# Altium project AD.PrjPCB
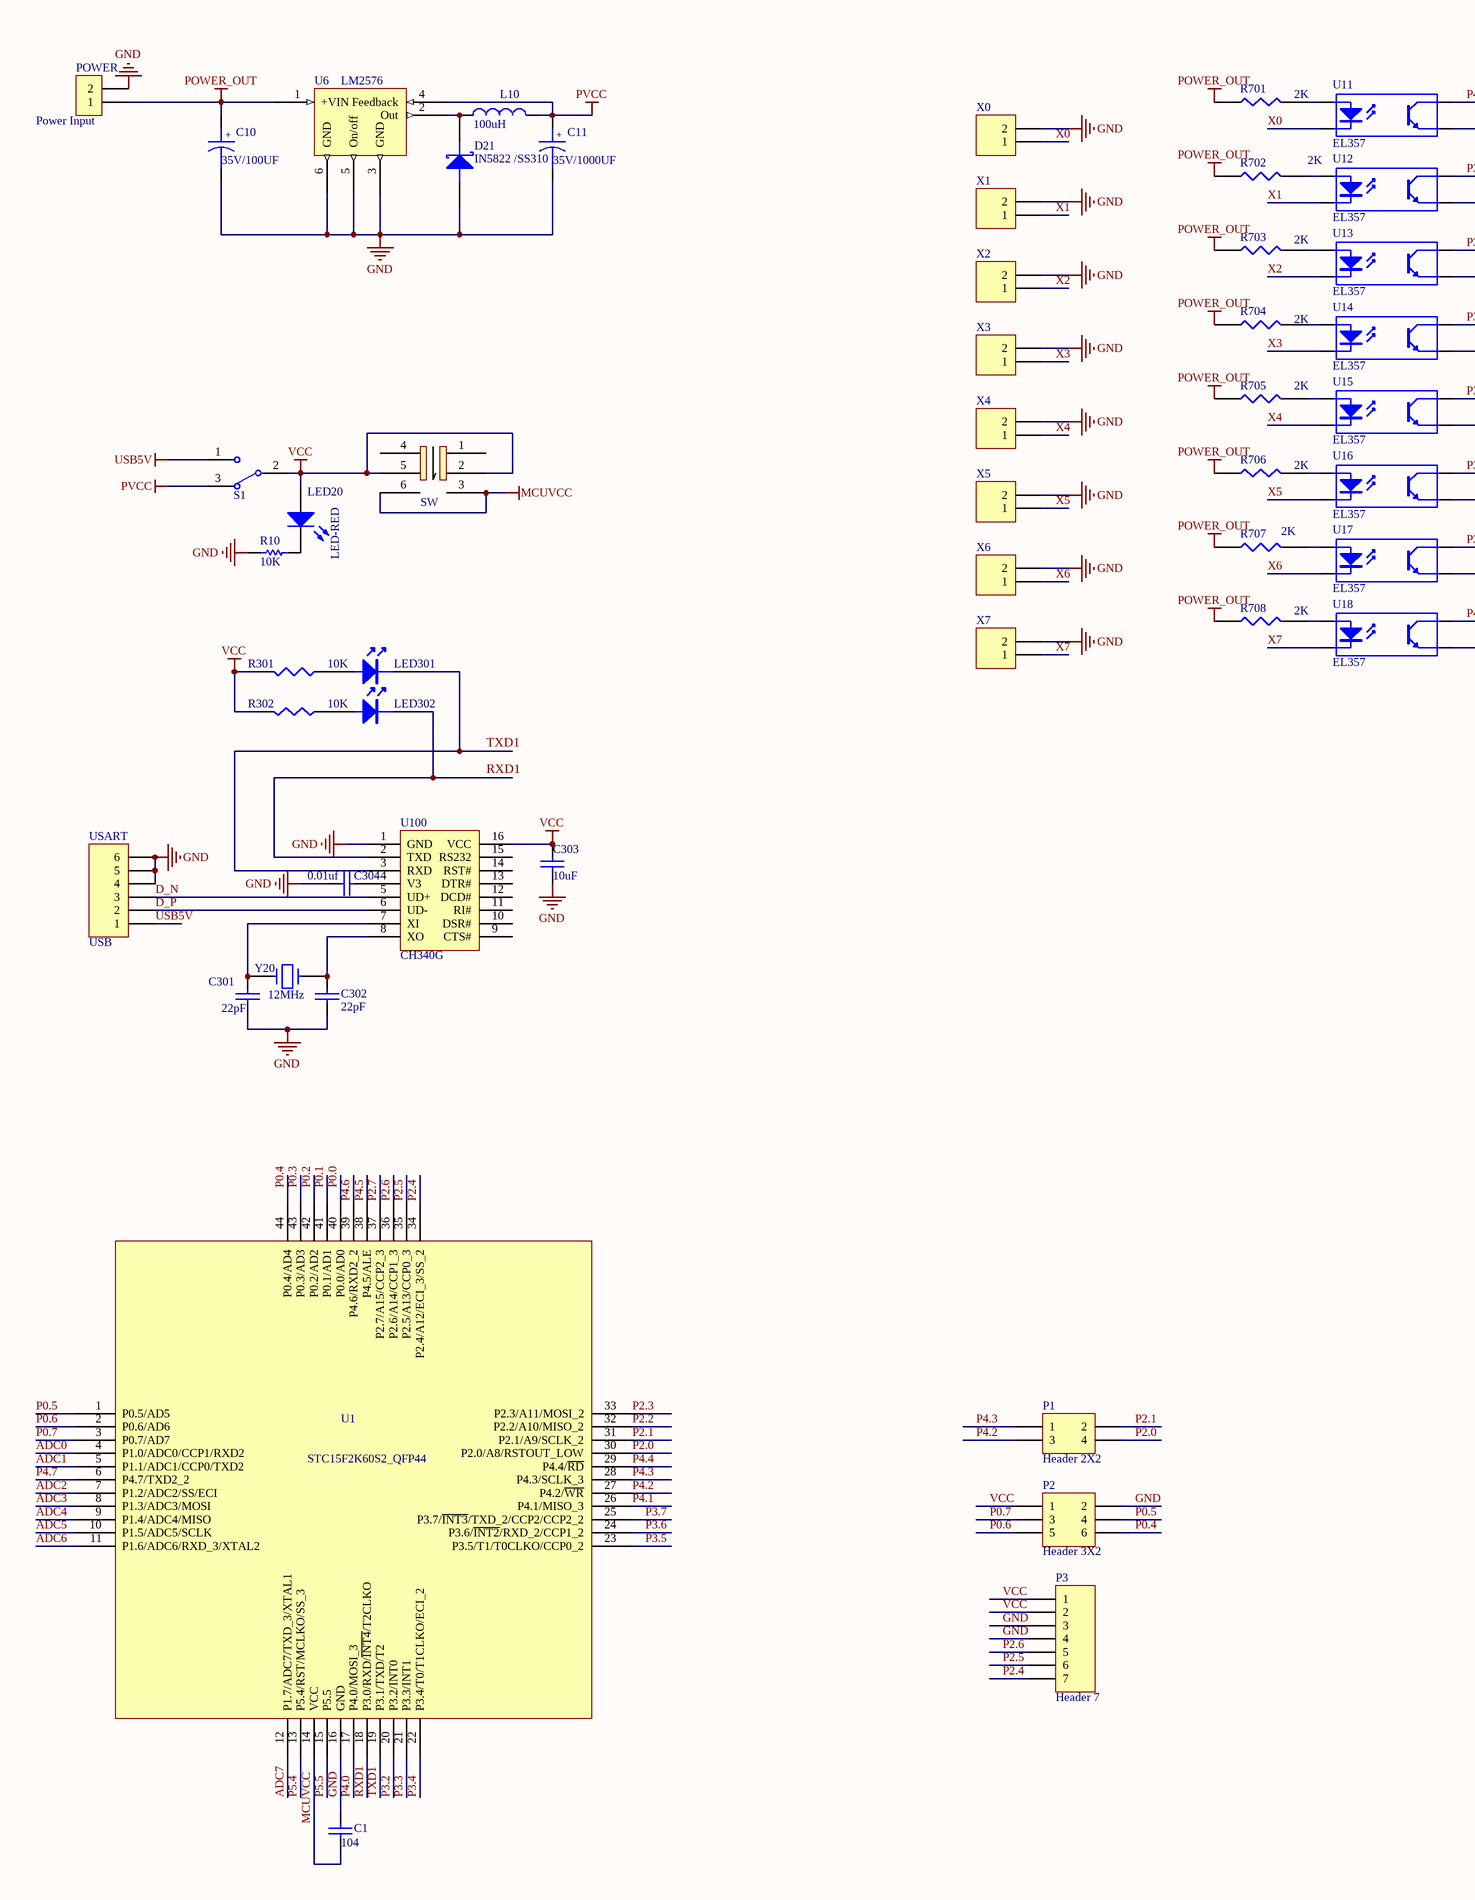
[diagram p0: AD.SchDoc, left]
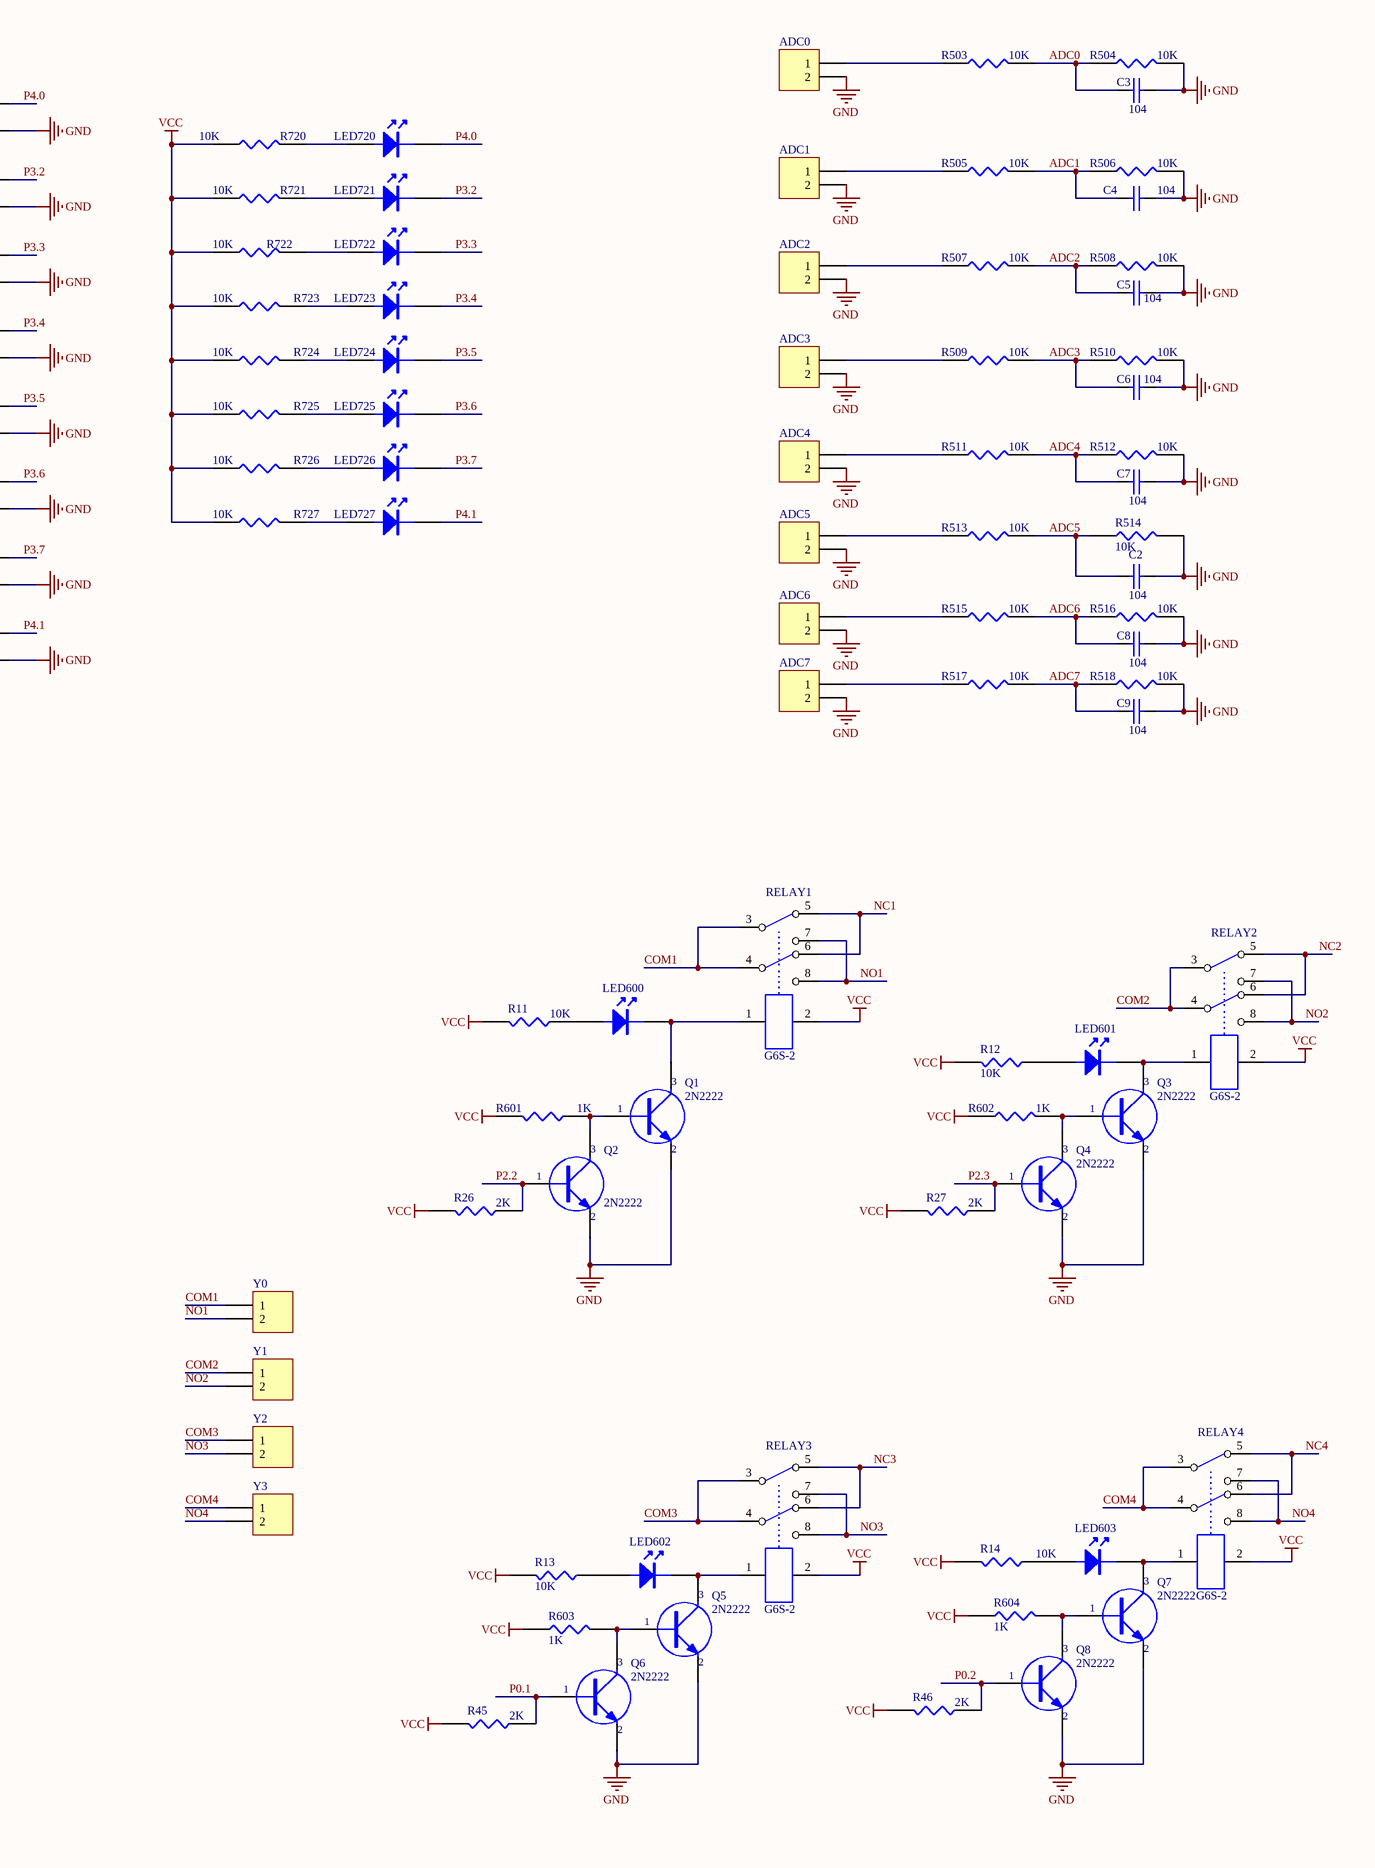
[diagram p1: AD.SchDoc, right]
1 sheet, 130 parts. Net scope: global (net labels, ports and power ports of the same name join across sheets).
Board file: AD.PcbDoc

## Sheet AD.SchDoc
size A2

### Parts
ADC0  ADC  [CON2_1]  (value not drawn)
ADC1  ADC  [CON2_1]  (value not drawn)
ADC2  ADC  [CON2_1]  (value not drawn)
ADC3  ADC  [CON2_1]  (value not drawn)
ADC4  ADC  [CON2_1]  (value not drawn)
ADC5  ADC  [CON2_1]  (value not drawn)
ADC6  ADC  [CON2_1]  (value not drawn)
ADC7  ADC  [CON2_1]  (value not drawn)
C1  104  [R0805]
C2  104  [R0805]
C3  104  [R0805]
C4  104  [R0805]
C5  104  [R0805]
C6  104  [R0805]
C7  104  [R0805]
C8  104  [R0805]
C9  104  [R0805]
C10  35V/100UF  [RB]
C11  35V/1000UF  [L-DIP]
C301  22pF  [C-0805]
C302  22pF  [C-0805]
C303  10uF  [R0805]
C304  0.01uf  [C-0805]
D21  IN5822 /SS310  [DO-214AC]
L10  100uH  [L-DIP]
LED20  LED-RED  [led-0805]
LED301  (no value)  [LED-0805]
LED302  (no value)  [LED-0805]
LED600  (no value)  [LED-0805]
LED601  (no value)  [LED-0805]
LED602  (no value)  [LED-0805]
LED603  (no value)  [LED-0805]
LED720  LED  [LED-0805]  (value not drawn)
LED721  LED  [LED-0805]  (value not drawn)
LED722  LED  [LED-0805]  (value not drawn)
LED723  LED  [LED-0805]  (value not drawn)
LED724  LED  [LED-0805]  (value not drawn)
LED725  LED  [LED-0805]  (value not drawn)
LED726  LED  [LED-0805]  (value not drawn)
LED727  LED  [LED-0805]  (value not drawn)
P1  Header 2X2  [HDR2X2]
P2  Header 3X2  [HDR2X3]
P3  Header 7  [HDR1X7]
POWER  Power Input  [CON2_1]
Q1  2N2222  [SOT23A]
Q2  2N2222  [SOT23A]
Q3  2N2222  [SOT23A]
Q4  2N2222  [SOT23A]
Q5  2N2222  [SOT23A]
Q6  2N2222  [SOT23A]
Q7  2N2222  [SOT23A]
Q8  2N2222  [SOT23A]
R10  10K  [R0805]
R11  10K  [R0805]
R12  10K  [R0805]
R13  10K  [R0805]
R14  10K  [R0805]
R26  2K  [R0805]
R27  2K  [R0805]
R45  2K  [R0805]
R46  2K  [R0805]
R301  10K  [R0805]
R302  10K  [R0805]
R503  10K  [R0805]
R504  10K  [R0805]
R505  10K  [R0805]
R506  10K  [R0805]
R507  10K  [R0805]
R508  10K  [R0805]
R509  10K  [R0805]
R510  10K  [R0805]
R511  10K  [R0805]
R512  10K  [R0805]
R513  10K  [R0805]
R514  10K  [R0805]
R515  10K  [R0805]
R516  10K  [R0805]
R517  10K  [R0805]
R518  10K  [R0805]
R601  1K  [R0805]
R602  1K  [R0805]
R603  1K  [R0805]
R604  1K  [R0805]
R701  2K  [R0805]
R702  2K  [R0805]
R703  2K  [R0805]
R704  2K  [R0805]
R705  2K  [R0805]
R706  2K  [R0805]
R707  2K  [R0805]
R708  2K  [R0805]
R720  10K  [R0805]
R721  10K  [R0805]
R722  10K  [R0805]
R723  10K  [R0805]
R724  10K  [R0805]
R725  10K  [R0805]
R726  10K  [R0805]
R727  10K  [R0805]
RELAY1  G6S-2  [G6S-2]
RELAY2  G6S-2  [G6S-2]
RELAY3  G6S-2  [G6S-2]
RELAY4  G6S-2  [G6S-2]
S1  SW-SPDT_2  [SW_1]  (value not drawn)
SW  SW  [SW]
U1  STC15F2K60S2_QFP44  [PQFP44]
U6  LM2576  [LM2576]
U11  EL357  [el357]
U12  EL357  [EL357]
U13  EL357  [EL357]
U14  EL357  [EL357]
U15  EL357  [EL357]
U16  EL357  [EL357]
U17  EL357  [EL357]
U18  EL357  [EL357]
U100  CH340G  [CH340G]
USART  USB  [USB2.0_A]
X0  XH2.54  [con2_1]  (value not drawn)
X1  XH2.54  [con2_1]  (value not drawn)
X2  XH2.54  [con2_1]  (value not drawn)
X3  XH2.54  [con2_1]  (value not drawn)
X4  XH2.54  [con2_1]  (value not drawn)
X5  XH2.54  [con2_1]  (value not drawn)
X6  XH2.54  [con2_1]  (value not drawn)
X7  XH2.54  [con2_1]  (value not drawn)
Y0  Header 2  [CON2_1]  (value not drawn)
Y1  Header 2  [CON2_1]  (value not drawn)
Y2  Header 2  [CON2_1]  (value not drawn)
Y3  Header 2  [CON2_1]  (value not drawn)
Y20  12MHz  [XTAL1]

### Nets
GND: ADC0.2 ADC1.2 ADC2.2 ADC3.2 ADC4.2 ADC5.2 ADC6.2 ADC7.2 C1.2 C2.2 C3.1 C4.1 C5.1 C6.1 C7.1 C8.1 C9.1 C10.2 C11.2 C301.2 C302.2 C303.2 C304.1 D21.1(A) P2.2 P3.3 P3.4 POWER.2 Q1.2(E) Q2.2(E) Q3.2(E) Q4.2(E) Q5.2(E) Q6.2(E) Q7.2(E) Q8.2(E) R10.1 R504.2 R506.2 R508.2 R510.2 R512.2 R514.2 R516.2 R518.2 U1.16(GND) U6.3(GND) U6.5(On/off) U6.6(GND) U11.3(E) U12.3(E) U13.3(E) U14.3(E) U15.3(E) U16.3(E) U17.3(E) U18.3(E) U100.1(GND) USART.4 USART.5 USART.6 X0.2 X1.2 X2.2 X3.2 X4.2 X5.2 X6.2 X7.2
MCUVCC: C1.1 SW.3 SW.6 U1.14(VCC)
POWER_OUT: C10.1 POWER.1 R701.1 R702.1 R703.1 R704.1 R705.1 R706.1 R707.1 R708.1 U6.1(+VIN)
PVCC: C11.1 L10.2 S1.3 U6.4(Feedback)
USB5V: S1.1 USART.1
VCC: C303.1 LED20.1(A) P2.1 P3.1 P3.2 R11.2 R12.2 R13.2 R14.2 R26.2 R27.2 R45.2 R46.2 R301.2 R302.2 R601.2 R602.1 R603.1 R604.1 R720.1 R721.1 R722.1 R723.1 R724.1 R725.1 R726.1 R727.1 RELAY1.2 RELAY2.2 RELAY3.2 RELAY4.2 S1.2 SW.2 SW.5 U100.16(VCC)
ADC0: C3.2 R503.2 R504.1 U1.4(P1.0/ADC0/CCP1/RXD2)
ADC1: C4.2 R505.2 R506.1 U1.5(P1.1/ADC1/CCP0/TXD2)
ADC2: C5.2 R507.2 R508.1 U1.7(P1.2/ADC2/SS/ECI)
ADC3: C6.2 R509.2 R510.1 U1.8(P1.3/ADC3/MOSI)
ADC4: C7.2 R511.2 R512.1 U1.9(P1.4/ADC4/MISO)
ADC5: C2.1 R513.2 R514.1 U1.10(P1.5/ADC5/SCLK)
ADC6: C8.2 R515.2 R516.1 U1.11(P1.6/ADC6/RXD_3/XTAL2)
ADC7: C9.2 R517.2 R518.1 U1.12(P1.7/ADC7/TXD_3/XTAL1)
COM1: RELAY1.3 RELAY1.4 Y0.1
COM2: RELAY2.3 RELAY2.4 Y1.1
COM3: RELAY3.3 RELAY3.4 Y2.1
COM4: RELAY4.3 RELAY4.4 Y3.1
D_N: U100.5(UD+) USART.3
D_P: U100.6(UD-) USART.2
NC1: RELAY1.5 RELAY1.6
NC2: RELAY2.5 RELAY2.6
NC3: RELAY3.5 RELAY3.6
NC4: RELAY4.5 RELAY4.6
NO1: RELAY1.7 RELAY1.8 Y0.2
NO2: RELAY2.7 RELAY2.8 Y1.2
NO3: RELAY3.7 RELAY3.8 Y2.2
NO4: RELAY4.7 RELAY4.8 Y3.2
P0.0: U1.40(P0.0/AD0)
P0.1: Q6.1(B) R45.1 U1.41(P0.1/AD1)
P0.2: Q8.1(B) R46.1 U1.42(P0.2/AD2)
P0.3: U1.43(P0.3/AD3)
P0.4: P2.6 U1.44(P0.4/AD4)
P0.5: P2.4 U1.1(P0.5/AD5)
P0.6: P2.5 U1.2(P0.6/AD6)
P0.7: P2.3 U1.3(P0.7/AD7)
P2.0: P1.4 U1.30(P2.0/A8/RSTOUT_LOW)
P2.1: P1.2 U1.31(P2.1/A9/SCLK_2)
P2.2: Q2.1(B) R26.1 U1.32(P2.2/A10/MISO_2)
P2.3: Q4.1(B) R27.1 U1.33(P2.3/A11/MOSI_2)
P2.4: P3.7 U1.34(P2.4/A12/ECI_3/SS_2)
P2.5: P3.6 U1.35(P2.5/A13/CCP0_3)
P2.6: P3.5 U1.36(P2.6/A14/CCP1_3)
P2.7: U1.37(P2.7/A15/CCP2_3)
P3.2: LED721.2 U1.20(P3.2/INT0) U12.4(C)
P3.3: LED722.2 U1.21(P3.3/INT1) U13.4(C)
P3.4: LED723.2 U1.22(P3.4/T0/T1CLKO/ECI_2) U14.4(C)
P3.5: LED724.2 U1.23(P3.5/T1/T0CLKO/CCP0_2) U15.4(C)
P3.6: LED725.2 U1.24(P3.6/~{INT2}/RXD_2/CCP1_2) U16.4(C)
P3.7: LED726.2 U1.25(P3.7/~{INT3}/TXD_2/CCP2/CCP2_2) U17.4(C)
P4.0: LED720.2 U1.17(P4.0/MOSI_3) U11.4(C)
P4.1: LED727.2 U1.26(P4.1/MISO_3) U18.4(C)
P4.2: P1.3 U1.27(P4.2/~{WR})
P4.3: P1.1 U1.28(P4.3/SCLK_3)
P4.4: U1.29(P4.4/~{RD})
P4.5: U1.38(P4.5/ALE)
P4.6: U1.39(P4.6/RXD2_2)
P4.7: U1.6(P4.7/TXD2_2)
P5.4: U1.13(P5.4/RST/MCLKO/SS_3)
P5.5: U1.15(P5.5)
RXD1: LED302.2 U1.18(P3.0/RXD/~{INT4}/T2CLKO) U100.2(TXD)
TXD1: LED301.2 U1.19(P3.1/TXD/T2) U100.3(RXD)
X0: U11.2(K) X0.1
X1: U12.2(K) X1.1
X2: U13.2(K) X2.1
X3: U14.2(K) X3.1
X4: U15.2(K) X4.1
X5: U16.2(K) X5.1
X6: U17.2(K) X6.1
X7: U18.2(K) X7.1
NetADC0_1: ADC0.1 R503.1
NetADC1_1: ADC1.1 R505.1
NetADC2_1: ADC2.1 R507.1
NetADC3_1: ADC3.1 R509.1
NetADC4_1: ADC4.1 R511.1
NetADC5_1: ADC5.1 R513.1
NetADC6_1: ADC6.1 R515.1
NetADC7_1: ADC7.1 R517.1
NetC301_1: C301.1 U100.7(XI) Y20.1
NetC302_1: C302.1 U100.8(XO) Y20.2
NetC304_2: C304.2 U100.4(V3)
NetD21_2: D21.2(K) L10.1 U6.2(Out)
NetLED20_2: LED20.2(K) R10.2
NetLED301_1: LED301.1 R301.1
NetLED302_1: LED302.1 R302.1
NetLED600_1: LED600.1 R11.1
NetLED600_2: LED600.2 Q1.3(C) RELAY1.1
NetLED601_1: LED601.1 R12.1
NetLED601_2: LED601.2 Q3.3(C) RELAY2.1
NetLED602_1: LED602.1 R13.1
NetLED602_2: LED602.2 Q5.3(C) RELAY3.1
NetLED603_1: LED603.1 R14.1
NetLED603_2: LED603.2 Q7.3(C) RELAY4.1
NetLED720_1: LED720.1 R720.2
NetLED721_1: LED721.1 R721.2
NetLED722_1: LED722.1 R722.2
NetLED723_1: LED723.1 R723.2
NetLED724_1: LED724.1 R724.2
NetLED725_1: LED725.1 R725.2
NetLED726_1: LED726.1 R726.2
NetLED727_1: LED727.1 R727.2
NetQ1_1: Q1.1(B) Q2.3(C) R601.1
NetQ3_1: Q3.1(B) Q4.3(C) R602.2
NetQ5_1: Q5.1(B) Q6.3(C) R603.2
NetQ7_1: Q7.1(B) Q8.3(C) R604.2
NetR701_2: R701.2 U11.1(A)
NetR702_2: R702.2 U12.1(A)
NetR703_2: R703.2 U13.1(A)
NetR704_2: R704.2 U14.1(A)
NetR705_2: R705.2 U15.1(A)
NetR706_2: R706.2 U16.1(A)
NetR707_2: R707.2 U17.1(A)
NetR708_2: R708.2 U18.1(A)

Not connected (* = marked no-connect by the designer): SW 1 4; U100 9(CTS#) 10(DSR#) 11(RI#) 12(DCD#) 13(DTR#) 14(RST#) 15(RS232)

### Notes on the sheet
- (in symbol CAP2) +

### Library data of the parts
ADC0-ADC7 X0-X7 Y0-Y3 = Header 2: Header, 2-Pin; LatestRevisionDate: 17-Jul-2002; LatestRevisionNote: Re-released for DXP Platform.; Publisher: Altium Limited
C1-C9 C301-C304 = CAP1
C10 C11 = CAP2
D21 = DIODE SCHOTTKY: Schottky Diode
L10 = Inductor: Code_IEC: 1005; Published: 8-Jun-2000; LatestRevisionDate: 17-Jul-2002; LatestRevisionNote: Re-released for DXP Platform.; PackageReference: 0402-A; Publisher: Altium Limited; Code_JEITA: 0402
LED20 = LED0: Typical INFRARED GaAs LED; Published: 8-Jun-2000; LatestRevisionDate: 08-Jul-2005; LatestRevisionNote: Mech Layer 1 removed.; PackageReference: LED-0; Publisher: Altium Limited
LED301 LED302 LED600-LED603 = LED
P1 = Header 2X2: Header, 2-Pin, Dual row; LatestRevisionDate: 17-Jul-2002; LatestRevisionNote: Re-released for DXP Platform.; Publisher: Altium Limited
P2 = Header 3X2: Header, 3-Pin, Dual row; LatestRevisionDate: 17-Jul-2002; LatestRevisionNote: Re-released for DXP Platform.; Publisher: Altium Limited
P3 = Header 7: Header, 7-Pin; LatestRevisionDate: 17-Jul-2002; LatestRevisionNote: Re-released for DXP Platform.; Publisher: Altium Limited
POWER = CON2
Q1-Q8 = NPN_S8050: NPN Transistor
R10 = Res Semi: Semiconductor Resistor; Value: 2k; Published: 8-Jun-2000; LatestRevisionDate: 17-Jul-2002; LatestRevisionNote: Re-released for DXP Platform.; PackageReference: AXIAL-0.5; Publisher: Altium Limited
R11-R14 R26 R27 R45 R46 R503-R518 R601-R604 R701-R708 R720-R727 = RES
R301 = Res3: Resistor; Published: 8-Jun-2000; LatestRevisionDate: 04-Mar-2005; LatestRevisionNote: PCB Footprint replaced.; PackageReference: J1-0603; Publisher: Altium Limited; Value: 10K
R302 = Res3: Resistor; Value: 2K; Published: 8-Jun-2000; LatestRevisionDate: 04-Mar-2005; LatestRevisionNote: PCB Footprint replaced.; PackageReference: J1-0603; Publisher: Altium Limited
RELAY1-RELAY4 = RELAY-G6S-2
S1 = SW-SPDT_2: SPDT Subminiature Toggle Switch, Right Angle Mounting, Vertical Actuation; Published: 24-Mar-1999; LatestRevisionDate: 17-Dec-2003; LatestRevisionNote: Schematic revised, PCB Footprint replaced.; DatasheetDocument: 05-Dec-2000; PackageReference: TL36WW15050; Publisher: Altium Limited; ComponentLink1Description: Manufacturer Link; ComponentLink1URL: http://www.apem.com
U11-U18 = Optoisolator: 4-Pin Phototransistor Optocoupler; Published: 24-Mar-1999; LatestRevisionDate: 04-Mar-2005; LatestRevisionNote: Sch pins 3 & 4 Swapped.; DatasheetDocument: Nov-2003; PackageReference: DIP-4; Publisher: Altium Limited
USART = Header 6: Header, 6-Pin; LatestRevisionDate: 17-Jul-2002; LatestRevisionNote: Re-released for DXP Platform.; Publisher: Altium Limited
Y20 = CRYSTAL